# EAGLE schematic meteo_withoutProg (EAGLE 9.3.0)
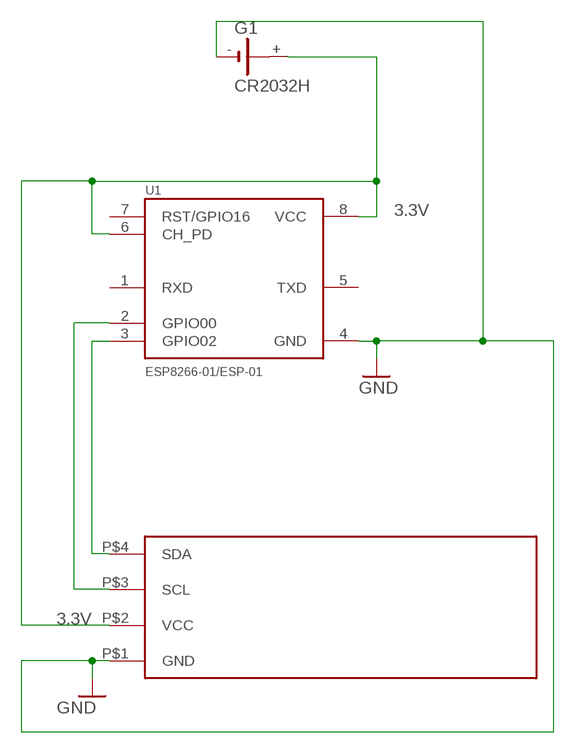
[diagram p0: schematic, sheet 1]

## Parts
G1  CR2032H  [CR2032H]
U1  ESP8266-01/ESP-01  [XCVR_ESP8266-01/ESP-01]
U$2  OLED  [SIP]

## Nets
3.3V: G1.+ U1.6(CH_PD) U1.8(VCC) U$2.P$2(VCC)
GND: G1.- U1.4(GND) U$2.P$1(GND)
N$2: U1.2(GPIO00) U$2.P$3(SCL)
N$4: U1.3(GPIO02) U$2.P$4(SDA)
Unconnected: G1.+@1(+) U1.1(RXD) U1.5(TXD) U1.7(RST/GPIO16)

## Library data of the parts
G1 = battery:CR2032H: LI BATTERY Varta
U1 = ESP8266-01_ESP-01:ESP8266-01/ESP-01: ESP-01 wifi module; AVAILABILITY: Unavailable; MF: AI-Thinker; MP: ESP8266-01/ESP-01; PACKAGE: None; PRICE: None
U$2 = OLED:OLED: I2C 0.91"128x32 OLED